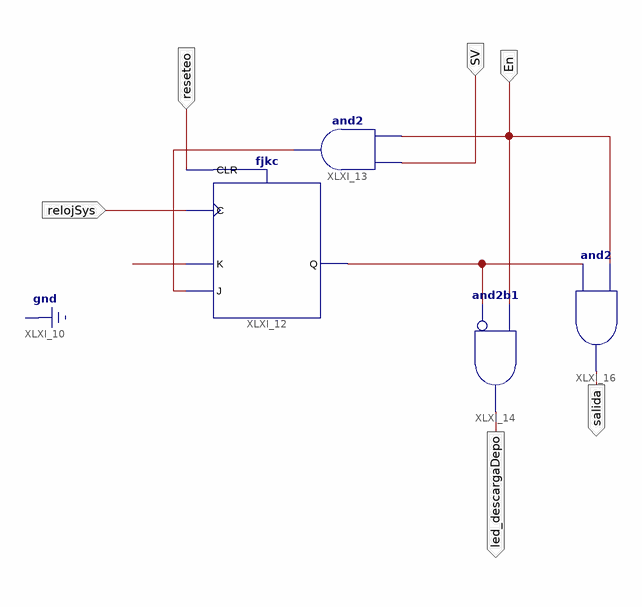
[diagram p0: schematic sheet 1]
// Xilinx ISE schematic vaciado.sch (spartan3e) as structural Verilog: 4 symbols, 6 ports
module vaciado (
  input  En,
  input  SV,
  input  reseteo,
  input  relojSys,
  output salida,
  output led_descargaDepo
);

  wire XLXN_22, XLXN_24;

  fjkc XLXI_12 (.C(relojSys), .CLR(reseteo), .J(XLXN_22), .K(1'b0), .Q(XLXN_24));
  and XLXI_13 (XLXN_22, En, SV);
  and XLXI_14 (led_descargaDepo, ~XLXN_24, En);  // and2b1
  and XLXI_16 (salida, XLXN_24, En);
endmodule
